# EAGLE design MoteinoMegaGPSSheild (EAGLE 7.5.0)
CNAME: MoteinoMega ABoatMon Shield; CREVISION: 0.999; DESIGNER: greg.cope@gmail.com
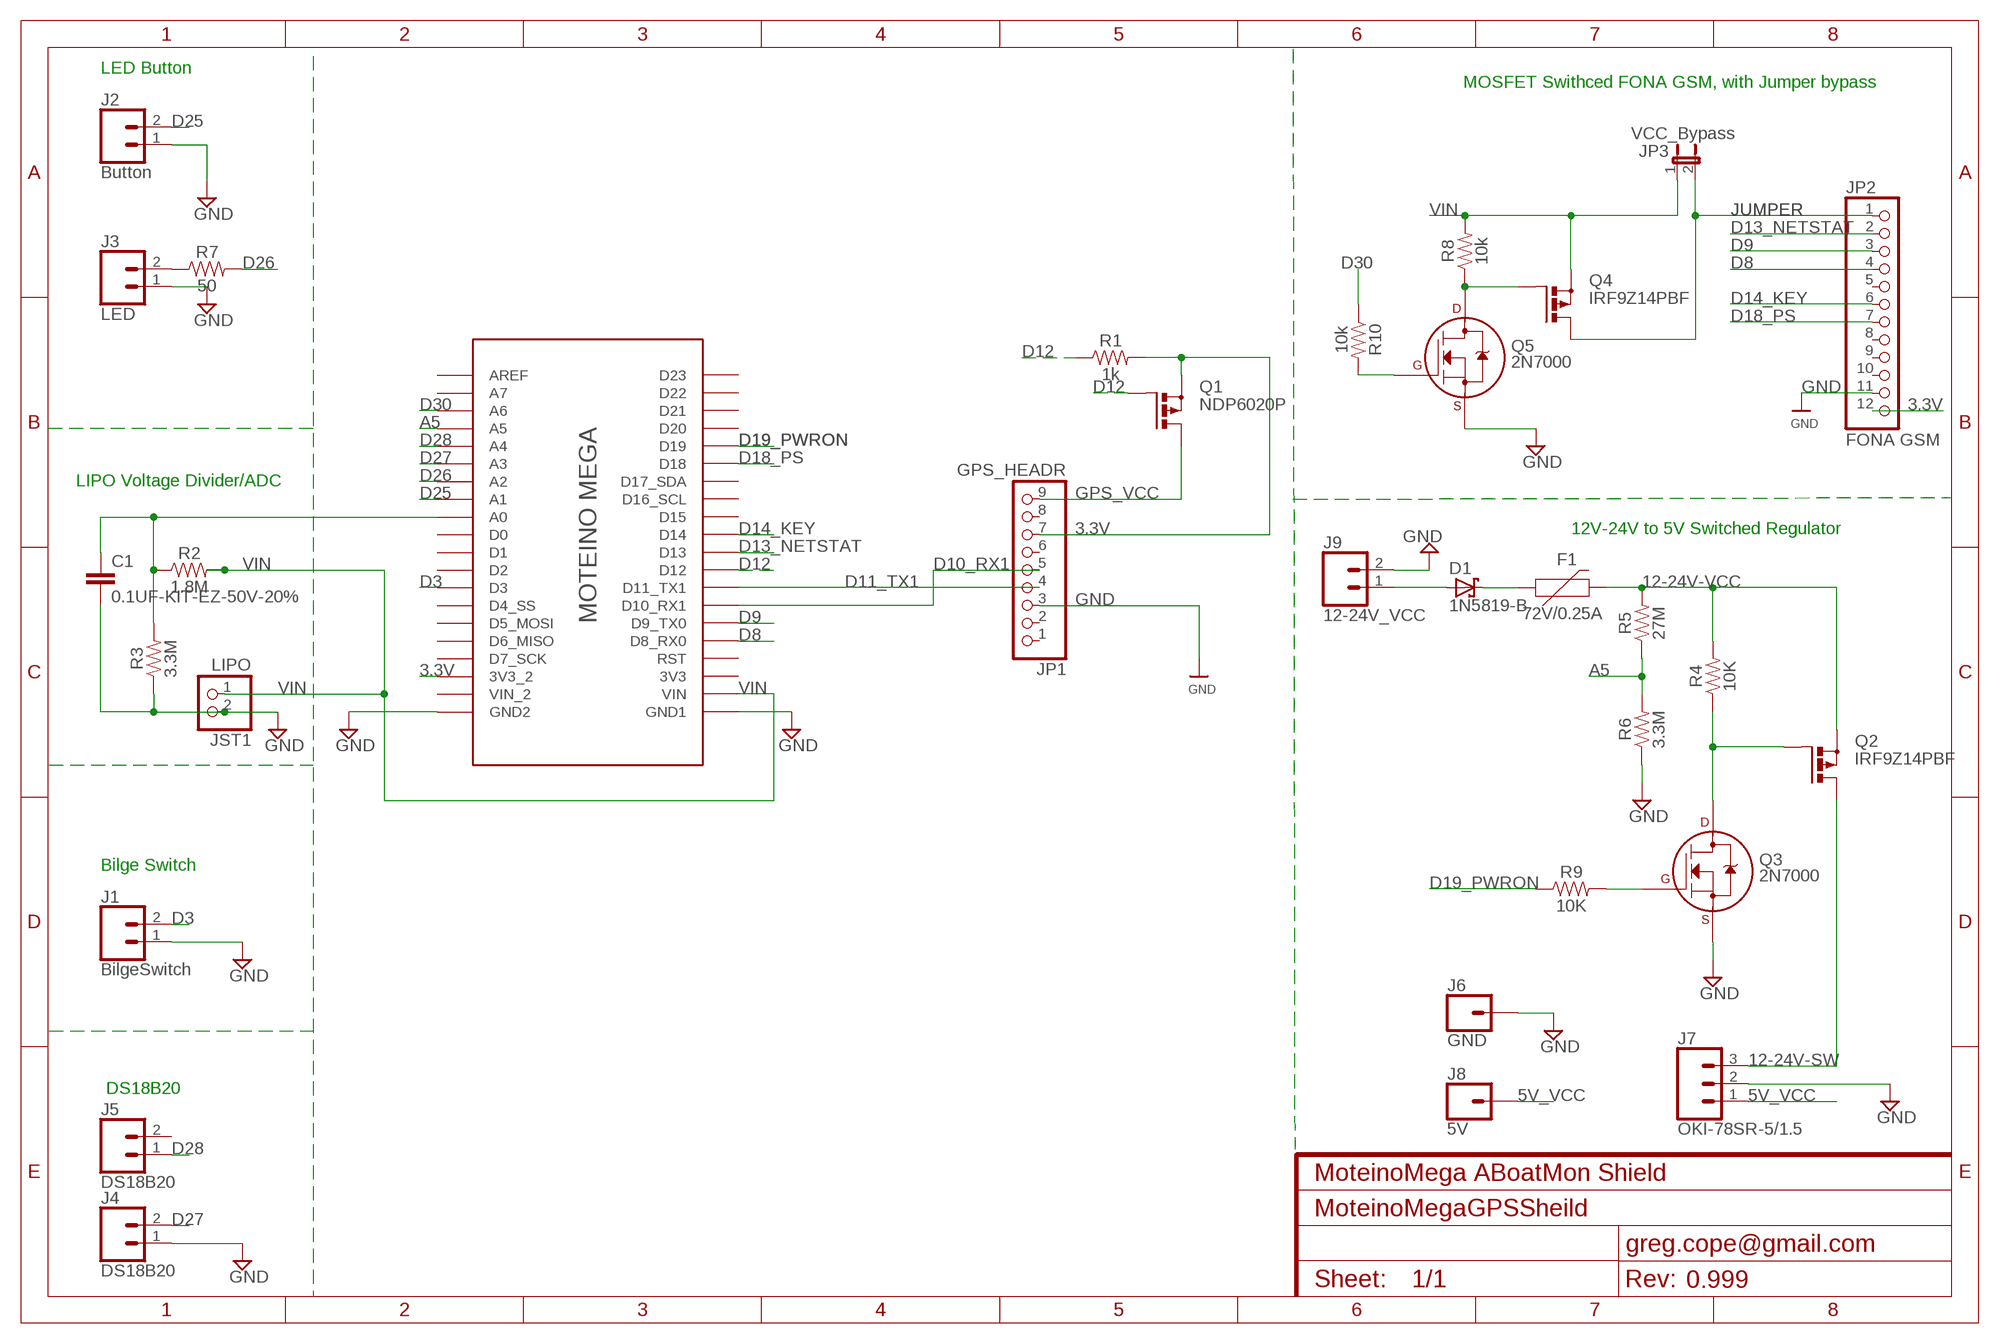
[diagram p0: schematic, sheet 1]

## Parts
C1  0.1UF-KIT-EZ-50V-20%  [CAP-PTH-SMALL-KIT]
D1  1N5819-B  [DO41-7.6]
F1  72V/0.25A  PPTC_PTH  [PTH]
J1  BilgeSwitch  CONN_023.5MM-NO_SILK  [SCREWTERMINAL-3.5MM-2-NS]
J2  Button  CONN_023.5MM-NO_SILK  [SCREWTERMINAL-3.5MM-2-NS]
J3  LED  CONN_023.5MM-NO_SILK  [SCREWTERMINAL-3.5MM-2-NS]
J4  DS18B20  CONN_023.5MM-NO_SILK  [SCREWTERMINAL-3.5MM-2-NS]
J5  DS18B20  CONN_023.5MM-NO_SILK  [SCREWTERMINAL-3.5MM-2-NS]
J6  GND  CONN_01  [1X01]
J7  OKI-78SR-5/1.5  CONN_03  [1X03]
J8  5V  CONN_01  [1X01]
J9  12-24V_VCC  CONN_023.5MM-NO_SILK  [SCREWTERMINAL-3.5MM-2-NS]
JP1  GPS_HEADR  HEADER-1X970MIL  [1X09_ROUND_70]
JP2  FONA GSM  PINHD-1X12-CB  [1X12-CB]
JP3  VCC_Bypass  JP1E  [JP1]
JST1  LIPO  JST_2PIN-THM  [JST-PH-2-THM]
MOTEINO_MEGA  HEADERS  MOTEINO_MEGA_SIMPLE  [MOTEINO_MEGA_SIMPLE]
Q1  NDP6020P  PMOSFET_PTO220BV  [TO220BV]
Q2  IRF9Z14PBF  PMOSFET_PTO220BV  [TO220BV]
Q3  2N7000  2N7002_TO92  [TO-92]
Q4  IRF9Z14PBF  PMOSFET_PTO220BV  [TO220BV]
Q5  2N7000  2N7002_TO92  [TO-92]
R1  1k  1KOHM-HORIZ-1/4W-1%  [AXIAL-0.3]
R2  1.8M  1KOHM-HORIZ-1/4W-1%  [AXIAL-0.3]
R3  3.3M  1KOHM-HORIZ-1/4W-1%  [AXIAL-0.3]
R4  10K  1KOHM-HORIZ-1/4W-1%  [AXIAL-0.3]
R5  27M  1KOHM-HORIZ-1/4W-1%  [AXIAL-0.3]
R6  3.3M  1KOHM-HORIZ-1/4W-1%  [AXIAL-0.3]
R7  50  1KOHM-HORIZ-1/4W-1%  [AXIAL-0.3]
R8  10k  1KOHM-HORIZ-1/4W-1%  [AXIAL-0.3]
R9  10K  1KOHM-HORIZ-1/4W-1%  [AXIAL-0.3]
R10  10k  1KOHM-HORIZ-1/4W-1%  [AXIAL-0.3]

## Nets
3.3V [power]: JP1.7 JP2.12 MOTEINO_MEGA.3V3_2 Q1.S R1.P$2
5V_VCC [power]: J7.1 J8.1
12-24V-SW [power]: J7.3 Q2.D
12-24V-VCC [power]: F1.P$2 Q2.S R4.P$2 R5.P$2
A0: C1.1 MOTEINO_MEGA.A0 R2.P$1 R3.P$2
A5: MOTEINO_MEGA.A5 R5.P$1 R6.P$2
D3: J1.2 MOTEINO_MEGA.D3
D8: JP2.4 MOTEINO_MEGA.D8(D8_RX0)
D9: JP2.3 MOTEINO_MEGA.D9(D9_TX0)
D10_RX1: JP1.5 MOTEINO_MEGA.D10(D10_RX1)
D11_TX1: JP1.4 MOTEINO_MEGA.D11(D11_TX1)
D12: MOTEINO_MEGA.D12 Q1.G R1.P$1
D13_NETSTAT: JP2.2 MOTEINO_MEGA.D13
D14_KEY: JP2.6 MOTEINO_MEGA.D14
D18_PS: JP2.7 MOTEINO_MEGA.D18
D19_PWRON: MOTEINO_MEGA.D19 R9.P$1
D25: J2.2 MOTEINO_MEGA.A1
D26: MOTEINO_MEGA.A2 R7.P$2
D27: J4.2 MOTEINO_MEGA.A3
D28: J5.1 MOTEINO_MEGA.A4
D30: MOTEINO_MEGA.A6 R10.P$1
GND [power]: C1.2 J1.1 J2.1 J3.1 J4.1 J6.1 J7.2 J9.2 JP1.3 JP2.11 JST1.2 MOTEINO_MEGA.GND1 MOTEINO_MEGA.GND_2(GND2) Q3.1(S) Q5.1(S) R3.P$1 R6.P$1
GPS_VCC [power]: JP1.9 Q1.D
JUMPER [power]: JP2.1 JP3.2 Q4.D
N$2 [power]: Q2.G Q3.3(D) R4.P$1
N$5 [power]: Q4.G Q5.3(D) R8.P$1
N$6 [power]: D1.A J9.1
N$7: J3.2 R7.P$1
N$8 [power]: D1.C F1.P$1
N$9: Q3.2(G) R9.P$2
N$10: Q5.2(G) R10.P$2
SPEAKER2+: JP2.10
VIN [power]: JP3.1 JST1.1 MOTEINO_MEGA.VIN Q4.S R2.P$2 R8.P$2
Unconnected: J5.2 JP1.1 JP1.2 JP1.6 JP1.8 JP2.5 JP2.8 JP2.9 MOTEINO_MEGA.3V3 MOTEINO_MEGA.A7 MOTEINO_MEGA.AREF MOTEINO_MEGA.D0 MOTEINO_MEGA.D1 MOTEINO_MEGA.D2 MOTEINO_MEGA.D4(D4_SS) MOTEINO_MEGA.D5(D5_MOSI) MOTEINO_MEGA.D6(D6_MISO) MOTEINO_MEGA.D7(D7_SCK) MOTEINO_MEGA.D15 MOTEINO_MEGA.D16(D16_SCL) MOTEINO_MEGA.D17(D17_SDA) MOTEINO_MEGA.D20 MOTEINO_MEGA.D21 MOTEINO_MEGA.D22 MOTEINO_MEGA.D23 MOTEINO_MEGA.RST MOTEINO_MEGA.VIN_2

## Notes on the sheet
- LED Button
- MOSFET Swithced FONA GSM, with Jumper bypass
- LIPO Voltage Divider/ADC
- 12V-24V to 5V Switched Regulator
- Bilge Switch
- DS18B20

## Library data of the parts
C1 = SparkFun-Capacitors:0.1UF: 0.1µF ceramic capacitors A capacitor is a passive two-terminal electrical component used to store electrical energy temporarily in an electric field.; PROD_ID: CAP-08370; VALUE: 0.1uF
D1 = diode:1N581*: 1.0A SCHOTTKY BARRIER RECTIFIER Source: http://www.diodes.com/datasheets/ds23001.pdf
F1 = SparkFun-Fuses:PPTC: Resettable Fuse PPTC Resettable Fuse. Really a sort of resistor with a polymeric positive temperature coefficient whose resistance increases dramatically with an increase in temperature. When heated by the power passing through the resistance rises causing the current to be limited, protecting the circuit. This is achieved by the transition of the polymer from a crystalline to an amorphous state where the conductive carbon separates breaking the conductive pathways found in the cool crystalline structure. When a PPTC cools back down it resumes conducting letting the circuit turn back on. SparkFun Products: SparkFun RedBoard - Programmed with Arduino <https://www.sparkfun.com/products/12757> Pro Micro - 5V/16MHz <https://www.sparkfun.com/products/12640> Arduino Pro 328 - 5V/16MHz <https://www.sparkfun.com/products/10915> MP3 Trigger <https://www.sparkfun.com/products/13720>; PROD_ID: RES-08490
J1-J5 J9 = SparkFun-Connectors:CONN_02: Multi connection point. Often used as Generic Header-pin footprint for 0.1 inch spaced/style header connections On any of the 0.1 inch spaced packages, you can populate with these: Break Away Headers - Straight <https://www.sparkfun.com/products/116> (PRT-00116) Break Away Male Headers - Right Angle <https://www.sparkfun.com/products/553> (PRT-00553) Female Headers <https://www.sparkfun.com/products/115> (PRT-00115) Break Away Headers - Machine Pin <https://www.sparkfun.com/products/117> (PRT-00117) Break Away Female Headers - Swiss Machine Pin <https://www.sparkfun.com/products/743> (PRT-00743) For SCREWTERMINALS and SPRING TERMINALS visit here: Screw Terimnals on SparkFun.com <https://www.sparkfun.com/search/results?term=Screw+Terminals> (5mm/3.5mm/2.54mm spacing) This device is also useful as a general connection point to wire up your design to another part of your project. Our various solder wires solder well into these plated through hole pads. Hook-Up Wire - Assortment (Stranded, 22 AWG) <https://www.sparkfun.com/products/11375> (PRT-11375) Hook-Up Wire - Assortment (Solid Core, 22 AWG) <https://www.sparkfun.com/products/11367> (PRT-11367) View the entire wire category on our website here <https://www.sparkfun.com/categories/141> Special notes: Molex polarized connector foot print use with: PRT-08233 with associated crimp pins and housings. 2.54_SCREWTERM for use with PRT-10571. 3.5mm Screw Terminal footprints for PRT-08084 5mm Screw Terminal footprints for use with PRT-08432; PROD_ID: CONN-08399
J6 J8 = SparkFun-Connectors:CONN_01: Single connection point. Often used as Generic Header-pin footprint for 0.1 inch spaced/style header connections On any of the 0.1 inch spaced packages, you can populate with these: Break Away Headers - Straight <https://www.sparkfun.com/products/116> (PRT-00116) Break Away Male Headers - Right Angle <https://www.sparkfun.com/products/553> (PRT-00553) Female Headers <https://www.sparkfun.com/products/115> (PRT-00115) Break Away Headers - Machine Pin <https://www.sparkfun.com/products/117> (PRT-00117) Break Away Female Headers - Swiss Machine Pin <https://www.sparkfun.com/products/743> (PRT-00743) This device is also useful as a general connection point to wire up your design to another part of your project. Our various solder wires solder well into these plated through hole pads. Hook-Up Wire - Assortment (Stranded, 22 AWG) <https://www.sparkfun.com/products/11375> (PRT-11375) Hook-Up Wire - Assortment (Solid Core, 22 AWG) <https://www.sparkfun.com/products/11367> (PRT-11367) View the entire wire category on our website here <https://www.sparkfun.com/categories/141> Special notes: SMTSO-256-ET is a "flush mount" nut for a 4-40 screw. We mostly use this on specialty testbeds; it is a nice way to connect hardware to your PCB at an adjustable hieght. Also note, the SNAP packages are for using a snappable style connector. We sell a baggie of snaps and they are also used on two LilyPad designs: Snap Assortment - 30 pack (male and female) <https://www.sparkfun.com/products/11347> (DEV-11347) LilyPad Arduino SimpleSnap <https://www.sparkfun.com/products/10941> (DEV-10941) LilyPad SimpleSnap Protoboard <https://www.sparkfun.com/products/10940> (DEV-10940)
J7 = SparkFun-Connectors:CONN_03: Multi connection point. Often used as Generic Header-pin footprint for 0.1 inch spaced/style header connections On any of the 0.1 inch spaced packages, you can populate with these: Break Away Headers - Straight <https://www.sparkfun.com/products/116> (PRT-00116) Break Away Male Headers - Right Angle <https://www.sparkfun.com/products/553> (PRT-00553) Female Headers <https://www.sparkfun.com/products/115> (PRT-00115) Break Away Headers - Machine Pin <https://www.sparkfun.com/products/117> (PRT-00117) Break Away Female Headers - Swiss Machine Pin <https://www.sparkfun.com/products/743> (PRT-00743) Stackable Header - 3 Pin (Female, 0.1") <https://www.sparkfun.com/products/13875> (PRT-13875) For SCREWTERMINALS and SPRING TERMINALS visit here: Screw Terimnals on SparkFun.com <https://www.sparkfun.com/search/results?term=Screw+Terminals> (5mm/3.5mm/2.54mm spacing) This device is also useful as a general connection point to wire up your design to another part of your project. Our various solder wires solder well into these plated through hole pads. Hook-Up Wire - Assortment (Stranded, 22 AWG) <https://www.sparkfun.com/products/11375> (PRT-11375) Hook-Up Wire - Assortment (Solid Core, 22 AWG) <https://www.sparkfun.com/products/11367> (PRT-11367) View the entire wire category on our website here <https://www.sparkfun.com/categories/141> Special notes: Molex polarized connector foot print use with SKU : PRT-08232 with associated crimp pins and housings.; PROD_ID: XXX-00000; VALUE: 455-1750-1-ND
JP1 = microbuilder:HEADER-1X9: PIN HEADER
JP2 = adafruit2:PINHD-1X12: PIN HEADER
JP3 = jumper:JP1E: JUMPER
JST1 = adafruit:JST_2PIN: JST 2-Pin Connectors of various flavors SMT-RA (S2B-PH-SM4) 4UConnector #17311 SMT (B2B-PH-SM4) THM-RA (S2B-PH) THM (B2B-PH)
MOTEINO_MEGA = Moteino:MOTEINO_MEGA_SIMPLE
Q1 Q2 Q4 = transistor-power:PMOSFET_P: Power MOSFET P-Channel
Q3 Q5 = transistors:2N700*: 2N7000, 2N7002, NDS7002A N-channel enhancement mode MOSFET
R1 = SparkFun-Resistors:1KOHM: 1kΩ resistor A resistor is a passive two-terminal electrical component that implements electrical resistance as a circuit element. Resistors act to reduce current flow, and, at the same time, act to lower voltage levels within circuits. - Wikipedia; PROD_ID: RES-12182
R2-R10 = SparkFun-Resistors:1KOHM: 1kΩ resistor A resistor is a passive two-terminal electrical component that implements electrical resistance as a circuit element. Resistors act to reduce current flow, and, at the same time, act to lower voltage levels within circuits. - Wikipedia; PROD_ID: RES-12182; VALUE: 1k

## Net classes
0 default: width 0.254 mm, clearance 0.254 mm
1 power: width 0.61 mm, clearance 0.254 mm

## Board
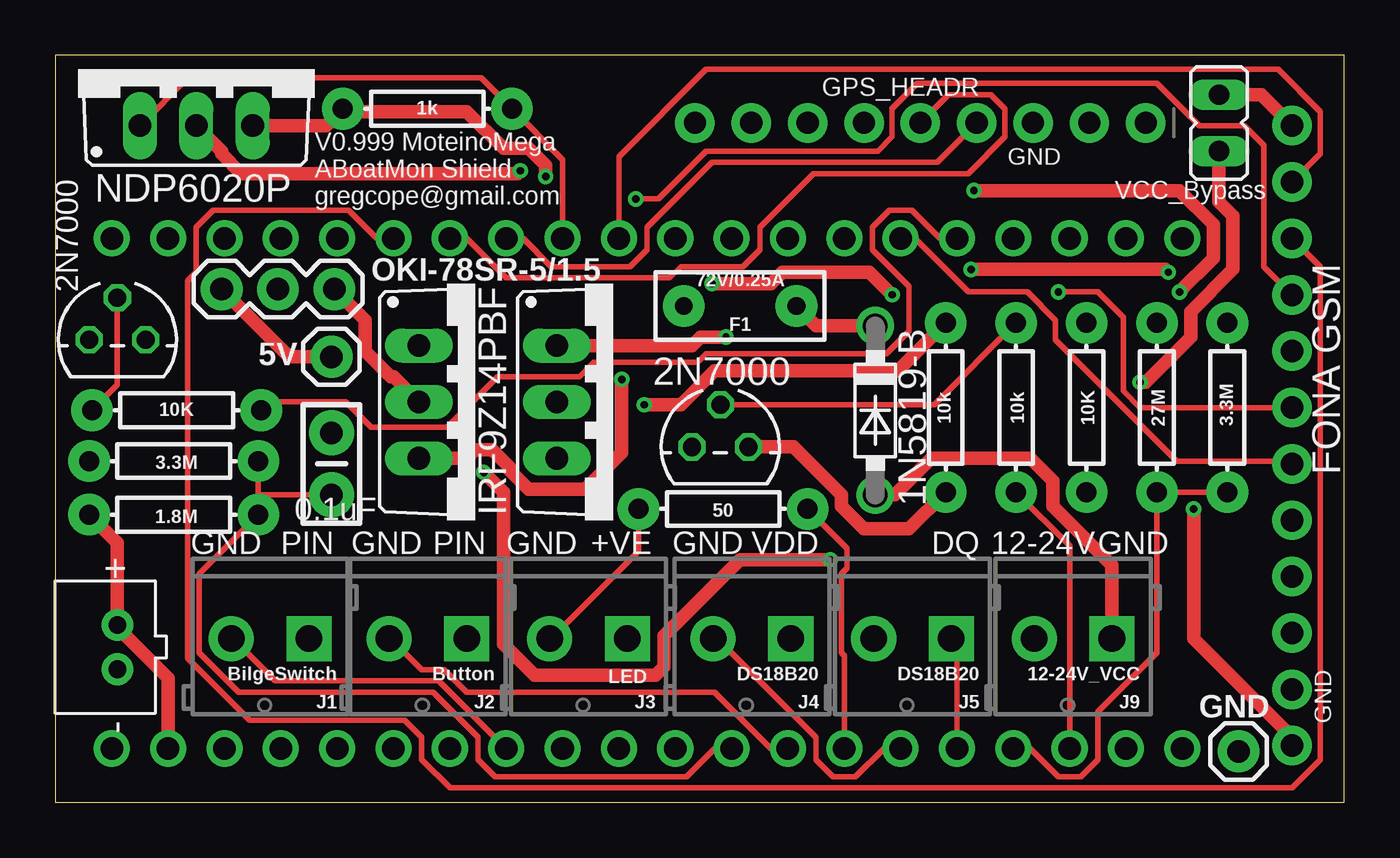
[diagram p1: board, top side]
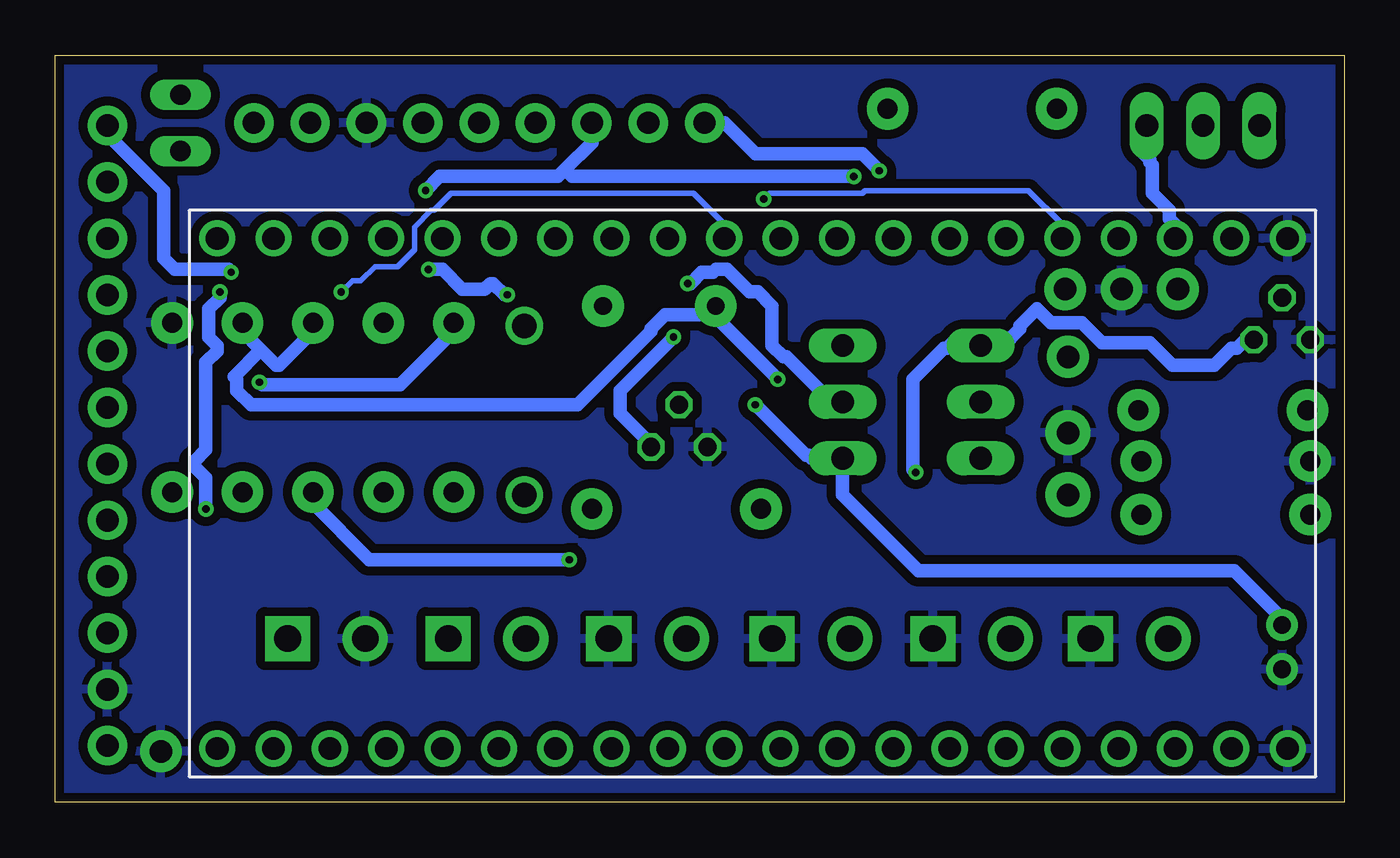
[diagram p2: board, bottom side, seen from below]

Size 58.09 x 33.64 mm. Coordinates in mm from the lower left corner, seen from the top.
Outline: 0,0 58.09,0 58.09,33.64 0,33.64 0,0
Copper layers (1*16): Top 0.0356mm / dielectric 1.5011mm / Bottom 0.0356mm
Design rules "oshpark-2layer": minimum track width 6mil, minimum drill 13mil, track to track 6mil, track to pad 6mil, pad to pad 6mil, via to via 6mil, smd to smd 6mil, copper to edge 15mil, drill to drill 6mil, minimum pad ring 7mil, minimum via ring 7mil, stop-mask expansion 2.5mil, vias tented up to drill 0mil, thermal gap 10mil

### Footprints (pad centres in the part's own frame; a part is rotated, then mirrored left to right if it is on the bottom)
CAP-PTH-SMALL-KIT = drill 1.016 pad 2.032: 1 -1.397,0; 2 1.397,0
DO41-7.6 = drill 1.1 pad 1.7: A 3.81,0; C -3.81,0
PTH = drill 0.8 pad 1.88: P$1 -2.54,0; P$2 2.54,0
SCREWTERMINAL-3.5MM-2-NS = drill 1.2 pad 2.032 square: 1 0,0 | drill 1.2 pad 2.032: 2 3.5,0
1X01 = drill 1.016 pad 1.88: 1 0,0
1X03 = drill 1.016 pad 1.88: 1 0,0; 2 2.54,0; 3 5.08,0
1X09_ROUND_70 = drill 1 pad 1.778: 1 -10.16,0; 2 -7.62,0; 3 -5.08,0; 4 -2.54,0; 5 0,0; 6 2.54,0; 7 5.08,0; 8 7.62,0; 9 10.16,0
1X12-CB = drill 1.016 pad 1.778: 1 -13.97,0; 2 -11.43,0; 3 -8.89,0; 4 -6.35,0; 5 -3.81,0; 6 -1.27,0; 7 1.27,0; 8 3.81,0; 9 6.35,0; 10 8.89,0; 11 11.43,0; 12 13.97,0
JP1 = drill 0.914 long: 1 0,-1.27; 2 0,1.27
JST-PH-2-THM = drill 0.8 pad 1.422: 1 1,0; 2 -1,0
MOTEINO_MEGA_SIMPLE = drill 1.016 pad 1.626: 3V3 6.35,24.257; 3V3_2 6.35,1.27; A0 29.21,24.257; A1 31.75,24.257; A2 34.29,24.257; A3 36.83,24.257; A4 39.37,24.257; A5 41.91,24.257; A6 44.45,24.257; A7 46.99,24.257; AREF 49.53,24.257; D0 26.67,24.257; D1 24.13,24.257; D2 21.59,24.257; D3 19.05,24.257; D4 16.51,24.257; D5 13.97,24.257; D6 11.43,24.257; D7 8.89,24.257; D8 11.43,1.27; D9 13.97,1.27; D10 16.51,1.27; D11 19.05,1.27; D12 21.59,1.27; D13 24.13,1.27; D14 26.67,1.27; D15 29.21,1.27; D16 31.75,1.27; D17 34.29,1.27; D18 36.83,1.27; D19 39.37,1.27; D20 41.91,1.27; D21 44.45,1.27; D22 46.99,1.27; D23 49.53,1.27; GND1 1.27,24.257; GND_2 1.27,1.27; RST 8.89,1.27; VIN 3.81,24.257; VIN_2 3.81,1.27
TO220BV = drill 1.016 long: D 0,-2.54; G -2.54,-2.54; S 2.54,-2.54
TO-92 = drill 0.813 octagon: 1 -1.27,0; 2 0,1.905; 3 1.27,0
AXIAL-0.3 = drill 0.9 pad 1.88: P$1 -3.81,0; P$2 3.81,0

### Placement (x,y rotation side)
C1  12.45,15.24 90 top
D1  36.96,17.65 270 top
F1  30.86,22.35 180 top
J1  11.43,7.37 180 top
J2  18.54,7.37 180 top
J3  25.78,7.37 180 top
J4  33.15,7.37 180 top
J5  40.39,7.37 180 top
J6  53.34,2.29 0 top
J7  7.49,23.11 0 top
J8  12.45,20.07 0 top
J9  47.62,7.37 180 top
JP1  38.99,30.61 180 top
JP2  55.75,16.51 270 top
JP3  52.45,30.61 0 top
JST1  2.79,6.98 90 top
MOTEINO_MEGA  1.27,26.67 180 bottom
Q1  6.35,33.02 0 top
Q2  18.92,18.03 270 top
Q3  2.79,20.83 0 top
Q4  25.15,18.03 270 top
Q5  29.97,16 0 top
R1  16.76,31.24 180 top
R2  5.33,12.95 180 top
R3  5.33,15.37 0 top
R4  46.48,17.78 90 top
R5  49.66,17.78 90 top
R6  52.83,17.78 270 top
R7  30.1,13.21 0 top
R8  40.13,17.78 90 top
R9  5.46,17.65 180 top
R10  43.31,17.78 90 top

### Tracks (layer width: path | path; a pad name or v marks a point on that pad's centre or on a via)
3.3V  (via drill 0.33)
  Top 0.61: Q1.S 12.19,30.48 R1.P$2 13.21,31.12 18.54,31.12 20.19,29.46 21.34,29.46 22.1,28.7 v22.1,28.19 | JP2.12 55.75,2.92 51.31,7.37 v51.31,13.21 | v50.67,22.99 52.2,24.51 52.2,26.03 50.67,27.56 v41.4,27.56
  Bottom 0.61: MOTEINO_MEGA.3V3_2 7.62,26.03 7.87,26.29 7.87,26.67 8.64,27.43 8.64,28.7 8.76,28.83 8.76,28.96 9.02,29.21 9.02,30.35 Q1.S | v51.31,13.21 51.31,14.6 51.82,15.11 51.82,15.37 51.31,15.88 51.31,19.81 50.8,20.32 50.8,20.57 51.18,20.95 51.18,22.23 50.67,22.73 v50.67,22.99 | v41.4,27.56 40.77,28.19 35.43,28.19 35.12,28.51 | 35.12,28.51 33.91,29.72 33.91,29.84 33.78,29.97 33.78,30.48 JP1.7 | v22.1,28.19 34.8,28.19 35.12,28.51
5V_VCC
  Top 0.61: J8.1 10.54,20.07 J7.1
12-24V-SW
  Top 0.61: Q2.D 15.24,19.18 15.11,19.18 13.97,20.32 13.97,21.72 J7.3
12-24V-VCC  (via drill 0.33)
  Top 0.61: Q2.S 18.54,15.49 18.92,15.88 19.68,15.88 20.45,15.11 20.45,14.99 21.34,14.1 23.88,14.1 25.53,15.75 v25.53,19.05
  Bottom 0.61: R4.P$2 46.48,21.21 48.01,19.69 48.13,19.69 48.83,20.38 | 48.83,20.38 49.66,21.21 R5.P$2 | v25.53,19.05 28.32,21.84 F1.P$2 28.57,22.1 28.96,22.1 29.08,21.97 30.61,21.97 31.24,21.34 31.24,21.21 34.54,17.91 49.28,17.91 49.91,18.54 49.91,19.05 50.04,19.18 48.83,20.38
A0
  Top 0.254: MOTEINO_MEGA.A0 29.72,2.41 28.45,1.14 19.81,1.14 19.05,1.9 19.05,2.92 17.02,4.95 8.26,4.95 6.48,6.73 6.48,10.29 R2.P$1 9.14,13.84 | 9.14,13.84 R3.P$2 | 9.14,13.84 C1.1
A5
  Top 0.254: MOTEINO_MEGA.A5 43.94,2.41 45.21,1.14 46.23,1.14 46.99,1.9 46.99,4.06 49.66,6.73 R5.P$1 R6.P$2
D3
  Top 0.254: MOTEINO_MEGA.D3 17.27,5.46 9.91,5.46 8,7.37 J1.2
D8  (via drill 0.33)
  Top 0.254: v26.16,27.18 27.18,27.18 29.34,29.34 37.08,29.34 37.72,29.97 37.72,31.24 38.86,32.38 49.66,32.38 51.56,30.48 53.59,30.48 54.48,29.59 54.48,24.13 JP2.4
  Bottom 0.254: MOTEINO_MEGA.D8 12.7,26.03 14.22,27.56 21.59,27.56 21.72,27.43 25.91,27.43 v26.16,27.18
D9
  Top 0.254: MOTEINO_MEGA.D9 14.48,25.4 13.21,26.67 7.11,26.67 6.35,25.91 6.35,23.88 5.97,23.49 5.97,6.48 8.76,3.68 15.75,3.68 16.51,2.92 16.51,1.9 17.78,0.63 55.75,0.63 57.02,1.9 57.02,24.13 JP2.3
D10_RX1
  Top 0.254: MOTEINO_MEGA.D10 18.54,25.4 20.32,23.62 27.69,23.62 28.19,24.13 30.99,24.13 31.75,24.89 31.75,25.91 34.16,28.32 41.15,28.32 42.8,29.97 42.8,31.24 42.16,31.88 40.26,31.88 JP1.5
D11_TX1
  Top 0.254: MOTEINO_MEGA.D11 21.08,25.4 22.35,24.13 25.91,24.13 26.67,24.89 26.67,25.91 29.59,28.83 39.75,28.83 JP1.4
D12
  Top 0.254: Q1.G 5.97,32.64 19.18,32.64 R1.P$1 22.86,28.96 MOTEINO_MEGA.D12
D13_NETSTAT
  Top 0.254: MOTEINO_MEGA.D13 25.4,29.08 29.34,33.02 55.12,33.02 57.02,31.12 57.02,29.21 JP2.2
D14_KEY  (via drill 0.33)
  Top 0.254: v45.21,22.99 46.99,22.99 48.13,21.84 48.13,18.54 48.9,17.78 JP2.6
  Bottom 0.254: MOTEINO_MEGA.D14 27.94,26.03 29.34,27.43 40.26,27.43 41.02,26.67 41.15,26.67 41.91,25.91 41.91,24.89 42.67,24.13 43.69,24.13 44.32,23.49 44.7,23.49 v45.21,22.99
D18_PS
  Top 0.254: MOTEINO_MEGA.D18 38.73,25.4 41.15,22.99 43.81,22.99 45.09,21.72 45.09,20.83 50.55,15.37 55.63,15.37 JP2.7
D19_PWRON
  Top 0.254: MOTEINO_MEGA.D19 39.88,25.4 38.61,26.67 37.59,26.67 36.83,25.91 36.83,24.89 38.48,23.24 38.48,21.21 37.47,20.19 29.34,20.19 28.96,19.81 24.26,19.81 23.62,19.18 19.94,19.18 17.65,16.89 14.22,16.89 13.08,18.03 9.65,18.03 R9.P$1
D25
  Top 0.254: MOTEINO_MEGA.A1 32.26,2.41 29.72,4.95 18.54,4.95 17.53,5.97 16.51,5.97 15.11,7.37 J2.2
D26
  Top 0.254: MOTEINO_MEGA.A2 35.56,6.6 35.43,6.73 35.43,10.29 35.69,10.54 35.69,11.43 R7.P$2
D27
  Top 0.254: MOTEINO_MEGA.A3 37.34,2.41 36.07,1.14 35.05,1.14 34.29,1.9 34.29,2.92 29.84,7.37 J4.2
D28
  Top 0.254: MOTEINO_MEGA.A4 40.64,7.11 J5.1
D30
  Top 0.254: MOTEINO_MEGA.A6 45.72,11.56 R10.P$1
GND
  pour Bottom (isolate 0.406): 0.38,33.27 57.78,33.27 57.78,0.38 0.38,0.38
GPS_VCC  (via drill 0.33)
  Top 0.61: Q1.D 7.49,29.34 7.49,29.21 8.38,28.32 20.83,28.32 v20.95,28.45
  Bottom 0.61: v20.95,28.45 21.72,29.21 26.54,29.21 27.94,30.61 28.07,30.61 28.19,30.73 28.7,30.73 JP1.9
JUMPER  (via drill 0.33)
  Top 0.61: JP3.2 54.36,31.88 JP2.1 | v29.59,23.37 32.26,23.37 32.77,23.88 36.7,23.88 v37.72,22.86 | v41.27,24 50.04,24 v50.16,23.88
  Bottom 0.61: Q4.D 23.11,18.03 25.15,20.07 25.27,20.07 25.78,20.57 25.78,22.35 26.42,22.99 26.8,22.99 27.81,24 28.32,24 28.45,23.88 28.96,23.88 29.46,23.37 v29.59,23.37 | v37.72,22.86 37.85,22.86 38.35,23.37 38.48,23.37 38.73,23.11 39.75,23.11 40.64,24 v41.27,24 | v50.16,23.88 50.29,24 52.7,24 53.21,24.51 53.21,27.56 55.75,30.1 JP2.1
N$2  (via drill 0.33)
  Top 0.61: v34.92,10.92 30.86,10.92 27.43,7.49 27.43,6.1 27.05,5.71 21.59,5.71 20.19,7.11 20.19,13.97 v19.3,14.86
  Bottom 0.61: Q3.3 4.45,20.83 4.83,20.45 5.08,20.45 5.84,19.69 7.75,19.69 8.76,20.7 10.92,20.7 11.81,21.59 13.21,21.59 13.84,22.23 14.61,21.46 14.61,21.34 15.37,20.57 Q2.G 16.64,20.7 17.65,20.7 17.91,20.45 18.03,20.45 19.43,19.05 19.43,14.99 v19.3,14.86 | R4.P$1 46.48,13.46 43.94,10.92 v34.92,10.92
N$5  (via drill 0.33)
  Top 0.61: Q5.3 33.27,16 35.43,13.84 35.43,13.34 36.45,12.32 38.48,12.32 R8.P$1 | Q4.G 28.7,20.57 29.08,20.95 v30.23,20.95
  Bottom 0.61: v30.23,20.95 32.64,18.54 32.64,17.53 31.24,16.13 Q5.3
N$6
  Top 0.61: D1.A 37.85,13.84 39.5,15.49 43.94,15.49 44.96,14.48 44.96,13.34 47.62,10.67 J9.1
N$7
  Top 0.254: R7.P$1 26.29,11.3 22.35,7.37 J3.2
N$8
  Top 0.61: D1.C 34.29,21.46 F1.P$1
N$9
  Top 0.254: Q3.2 2.79,18.8 R9.P$2
N$10
  Top 0.254: Q5.2 39.62,17.91 R10.P$2
VIN  (via drill 0.33)
  Top 0.61: R2.P$2 2.79,11.68 JST1.1 2.92,7.75 5.08,5.59 MOTEINO_MEGA.VIN | JP3.1 52.45,27.05 53.09,26.42 53.09,24 51.18,22.1 51.18,20.95 49.15,18.92 v48.9,18.92 | v26.54,17.91 28.19,17.91 29.72,19.43 37.97,19.43 R8.P$2
  Bottom 0.61: v48.9,18.92 48.77,18.8 42.55,18.8 40.13,21.21 R8.P$2 | v26.54,17.91 24.26,15.62 24.13,15.62 24,15.49 Q4.S 22.61,13.84 19.18,10.41 4.95,10.41 2.79,8.26 JST1.1

### Text on the board
tPlace: GND
tNames: GND | V0.999 MoteinoMega / ABoatMon Shield / gregcope@gmail.com | 0.1uF | GND | PIN | GND | PIN | GND | +VE | VDD | DQ | 12-24V | GND | GND